# Altium schematic sheet USB_OTG.SchDoc: USB_OTG
size 420 x 297 mm; DrawnBy: Orhun Dabak; Revision: 1.0; SheetNumber: 3; SheetTotal: 7; SPICEModelCacheBLVHRVRQ: <root> / <DocumentId>BLVHRVRQ</DocumentId> / </root>
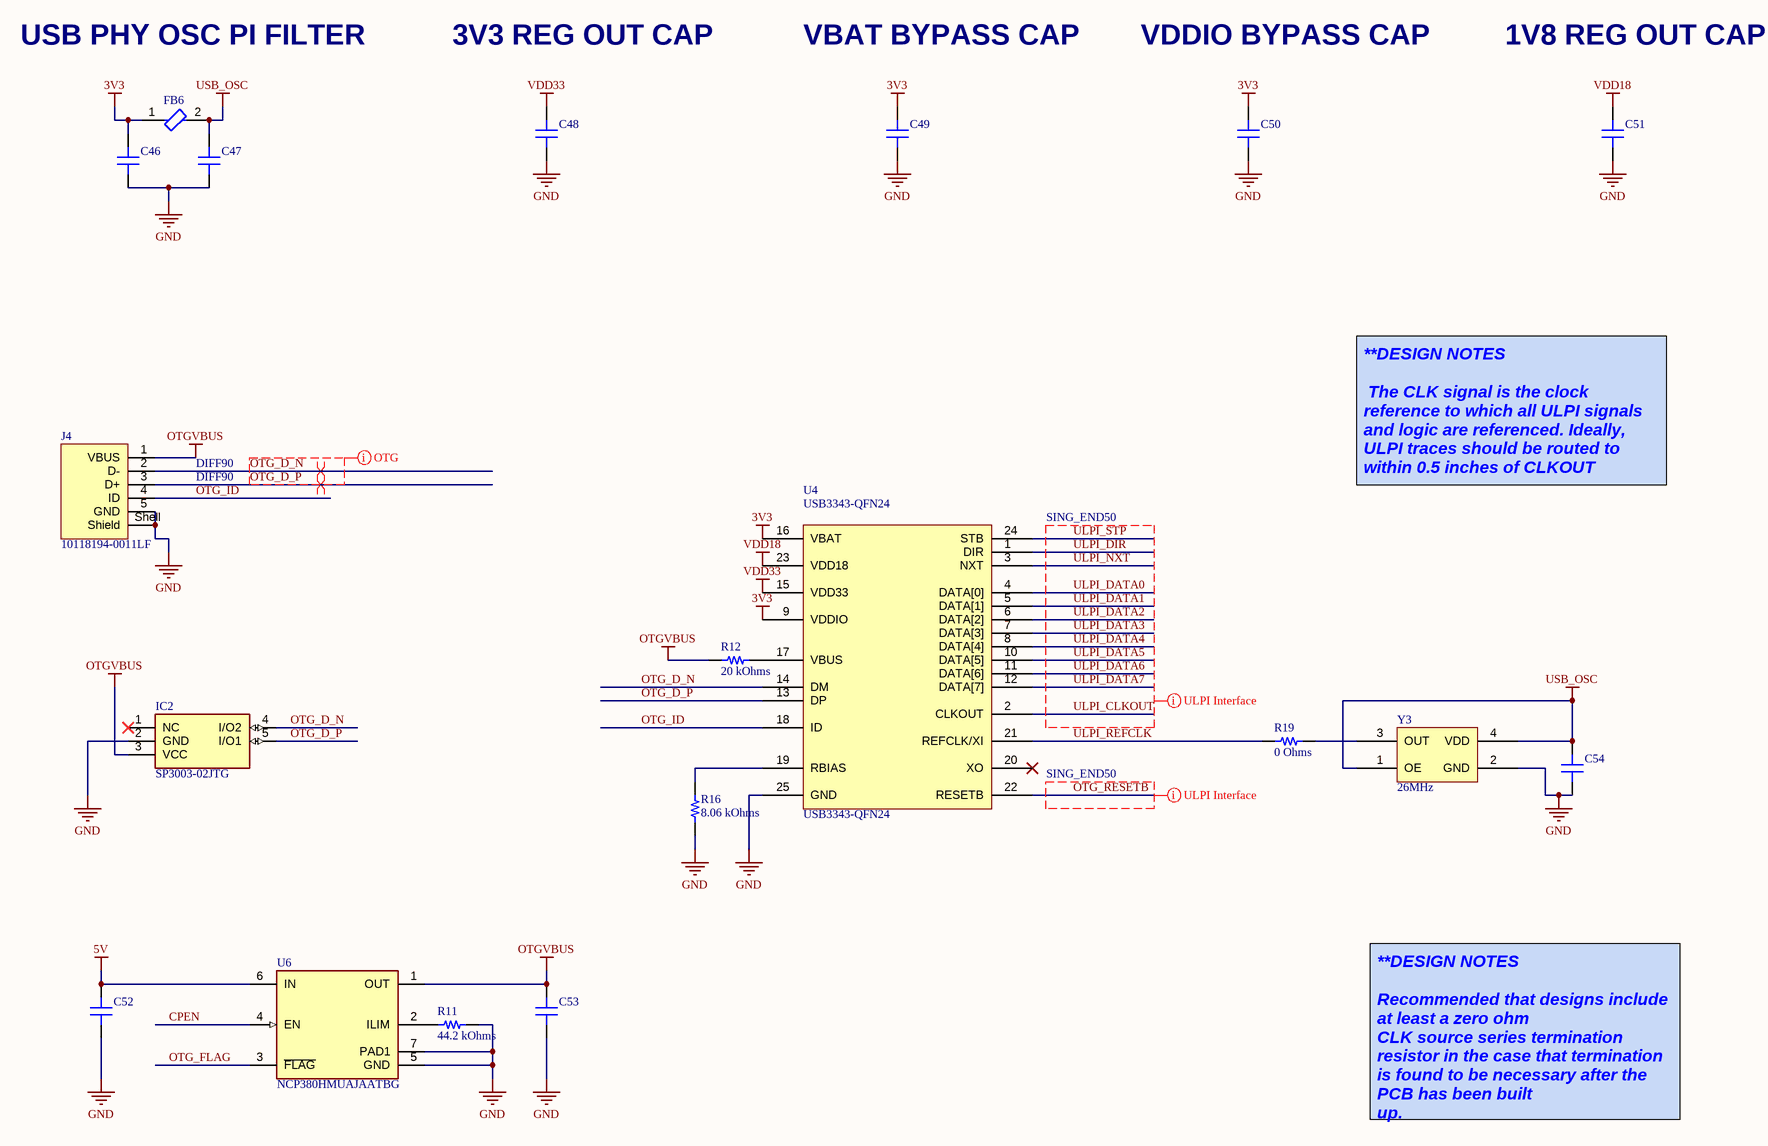
[diagram p0: USB_OTG.SchDoc]

## Parts
?  (no value)  (graphical)
C46  4.7 µF  [CAP 0402_1005]  (value not drawn)
C47  4.7 µF  [CAP 0402_1005]  (value not drawn)
C48  4.7µF  [CAP 0402_1005]  (value not drawn)
C49  0.1 µF  [CAP 0402_1005]  (value not drawn)
C50  0.1 µF  [CAP 0402_1005]  (value not drawn)
C51  4.7µF  [CAP 0402_1005]  (value not drawn)
C52  10 µF  [CAP 0402_1005]  (value not drawn)
C53  4.7 µF  [CAP 1210_3225 - 1MM]  (value not drawn)
C54  10000 pF  [CAP 0402_1005]  (value not drawn)
FB6  BLM15AX601SN1D  [FP-BLM15-0_05-IPC_B]  (value not drawn)
IC2  SP3003-02JTG  [SOT65P220X110-5N]
J4  10118194-0011LF  [10118194-0011LF]
R11  44.2 kOhms  [RES 0402_1005]
R12  20 kOhms  [RES 0402_1005]
R16  8.06 kOhms  [RES 0402_1005]
R19  0 Ohms  [RES 0402_1005]
U4  USB3343-QFN24  [QFN50P400X400X85_HS-25N]
U6  NCP380HMUAJAATBG  [FP-517AB-MFG]
Y3  26MHz  [ABRACON ASVTX-11]

## Nets
3V3: C46.2 C49.2 C50.2 FB6.1 U4.9(VDDIO) U4.16(VBAT)
5V: C52.2 U6.6(IN)
GND: C46.1 C47.1 C48.1 C49.1 C50.1 C51.1 C52.1 C53.1 C54.1 IC2.2(GND) J4.5(GND) J4.Shell(Shield) R11.2 R16.2 U4.25(GND) U6.5(GND) U6.7(PAD1) Y3.2(GND)
OTGVBUS: C53.2 IC2.3(VCC) J4.1(VBUS) R12.1 U6.1(OUT)
USB_OSC: C47.2 C54.2 FB6.2 Y3.1(OE) Y3.4(VDD)
VDD18: C51.2 U4.23(VDD18)
VDD33: C48.2 U4.15(VDD33)
CPEN: U6.4(EN)
OTG_D_N: IC2.4(I/O2) J4.2(D-) U4.14(DM)
OTG_D_P: IC2.5(I/O1) J4.3(D+) U4.13(DP)
OTG_FLAG: U6.3(~{FLAG})
OTG_ID: J4.4(ID) U4.18(ID)
OTG_RESETB: U4.22(RESETB)
ULPI_CLKOUT: U4.2(CLKOUT)
ULPI_DATA0: U4.4(DATA[0])
ULPI_DATA1: U4.5(DATA[1])
ULPI_DATA2: U4.6(DATA[2])
ULPI_DATA3: U4.7(DATA[3])
ULPI_DATA4: U4.8(DATA[4])
ULPI_DATA5: U4.10(DATA[5])
ULPI_DATA6: U4.11(DATA[6])
ULPI_DATA7: U4.12(DATA[7])
ULPI_DIR: U4.1(DIR)
ULPI_NXT: U4.3(NXT)
ULPI_REFCLK: R19.1 U4.21(REFCLK/XI)
ULPI_STP: U4.24(STB)
NetR11_1: R11.1 U6.2(ILIM)
NetR12_2: R12.2 U4.17(VBUS)
NetR16_1: R16.1 U4.19(RBIAS)
NetR19_2: R19.2 Y3.3(OUT)

Not connected (* = marked no-connect by the designer): IC2 1(NC)*; U4 20(XO)*

## Layout directives
net class SING_END50; net class ULPI: OTG_RESETB, ULPI_CLKOUT, ULPI_DATA0, ULPI_DATA1, ULPI_DATA2, ULPI_DATA3, ULPI_DATA4, ULPI_DATA5, ULPI_DATA6, ULPI_DATA7, ULPI_DIR, ULPI_NXT, ULPI_STP
differential pair; differential pair class DIFF90: OTG_D_N, OTG_D_P
net class *OTG: OTG_D_N, OTG_D_P

## Notes on the sheet
- USB PHY OSC PI FILTER
- 3V3 REG OUT CAP
- VBAT BYPASS CAP
- VDDIO BYPASS CAP
- 1V8 REG OUT CAP
- **DESIGN NOTES
  The CLK signal is the clock reference to which all ULPI signals and logic are referenced. Ideally, ULPI traces should be routed to within 0.5 inches of CLKOUT
- **DESIGN NOTES
  Recommended that designs include at least a zero ohm
  CLK source series termination resistor in the case that termination is found to be necessary after the PCB has been built
  up.
- Title:
- Project:
- Size:
- Date:
- File:
- A3
- Time:
- Drawn By:
- Sheet:
- Revision:
- Of

## Library data of the parts
? = Title_Block
C46 C47 = CL05A475MP5NRNC: CAP CER 4.7UF 10V X5R 0402; manufacturer: Samsung Electro-Mechanics; Tolerance: ±20%; Part Number: CL05A475MP5NRNC; Value: 4.7 µF; Applications: General Purpose; Capacitance: 4.7 µF; componentlink1description: Datasheet; componentlink1url: http://www.samsungsem.com/kr/support/product-search/mlcc/CL05A475MP5NRNC.jsp; componentlink2description: DigiKey Link; componentlink2url: https://www.digikey.com/en/products/detail/samsung-electro-mechanics/CL05A475MP5NRNC/3887140; Device Package: 0402 (1005 Metric); lastupdated: 19/09/2022 12:57:17; Lifecycle Status: Active; Minimum Order: 1; Mounting Type: Surface Mount, MLCC; Operating Temperature: -55°C ~ 85°C; Package / Case: 0402 (1005 Metric); packaging: TapeAndReel; partid: 7650; Part Status: Active; price: 0.01; series: CL; Size / Dimension: 0.039" L x 0.020" W (1.00mm x 0.50mm); Supplier 1: DigiKey; Supplier Part Number 1: 1276-1482-1-ND; Temperature Coefficient: X5R; Thickness (Max): 0.022" (0.55mm); Voltage - Rated: 10V
C48 C51 = 0402YD475MAT2A: CAP CER 4.7UF 16V X5R 0402; manufacturer: AVX Corporation; Tolerance: ±20%; Part Number: 0402YD475MAT2A; Value: 4.7µF; Applications: General Purpose; Capacitance: 4.7µF; componentlink1description: Datasheet; componentlink1url: http://datasheets.avx.com/cx5r.pdf; componentlink2description: DigiKey Link; componentlink2url: http://digikey.com/product-detail/en/avx-corporation/0402YD475MAT2A/478-10788-1-ND/7536324; Device Package: 0402 (1005 Metric); lastupdated: 08/02/2022 12:26:39; Lifecycle Status: Active; Minimum Order: 1; Mounting Type: Surface Mount, MLCC; Operating Temperature: -55°C ~ 85°C; Package / Case: 0402 (1005 Metric); packaging: TapeAndReel; partid: 12460; Part Status: Active; price: 0.06; series: -; Size / Dimension: 0.039" L x 0.020" W (1.00mm x 0.50mm); Supplier 1: DigiKey; Supplier Part Number 1: 478-10788-1-ND; Temperature Coefficient: X5R; Thickness (Max): 0.028" (0.71mm); Voltage - Rated: 16V
C49 C50 = CC0402KRX7R6BB104: CAP CER 0.1UF 10V X7R 0402; manufacturer: Yageo; Tolerance: ±10%; Part Number: CC0402KRX7R6BB104; Value: 0.1 µF; Applications: General Purpose; Capacitance: 0.1 µF; componentlink1description: Datasheet; componentlink1url: https://www.yageo.com/upload/media/product/productsearch/datasheet/mlcc/UPY-GPHC_X7R_6.3V-to-50V_18.pdf; componentlink2description: DigiKey Link; componentlink2url: https://www.digikey.com/en/products/detail/yageo/CC0402KRX7R6BB104/2103083; Device Package: 0402 (1005 Metric); lastupdated: 19/09/2022 12:57:28; Lifecycle Status: Active; Minimum Order: 1; Mounting Type: Surface Mount, MLCC; Operating Temperature: -55°C ~ 125°C; Package / Case: 0402 (1005 Metric); packaging: CutTape; partid: 3877; Part Status: Active; price: 0.01; series: CC; Size / Dimension: 0.039" L x 0.020" W (1.00mm x 0.50mm); Supplier 1: DigiKey; Supplier Part Number 1: 311-1345-1-ND; Temperature Coefficient: X7R; Thickness (Max): 0.022" (0.55mm); Voltage - Rated: 10V
C52 = CL05A106MP8NUB8: CAP CER 10UF 10V X5R 0402; manufacturer: Samsung Electro-Mechanics; Tolerance: ±20%; Part Number: CL05A106MP8NUB8; Value: 10 µF; Applications: General Purpose; Capacitance: 10 µF; componentlink1description: Datasheet; componentlink1url: http://www.samsungsem.com/kr/support/product-search/mlcc/CL05A106MP8NUB8.jsp; componentlink2description: DigiKey Link; componentlink2url: https://www.digikey.com/en/products/detail/samsung-electro-mechanics/CL05A106MP8NUB8/5961314; Device Package: 0402 (1005 Metric); lastupdated: 19/09/2022 12:57:36; Lifecycle Status: Active; Minimum Order: 1; Mounting Type: Surface Mount, MLCC; Operating Temperature: -55°C ~ 85°C; Package / Case: 0402 (1005 Metric); packaging: TapeAndReel; partid: 1758; Part Status: Active; price: 0.06; series: CL; Size / Dimension: 0.039" L x 0.020" W (1.00mm x 0.50mm); Supplier 1: DigiKey; Supplier Part Number 1: 1276-6830-1-ND; Temperature Coefficient: X5R; Thickness (Max): 0.035" (0.90mm); Voltage - Rated: 10V
C53 = GMK325BJ475MN-T: CAP CER 4.7UF 35V X5R 1210; manufacturer: Taiyo Yuden; Tolerance: ±20%; Part Number: GMK325BJ475MN-T; Value: 4.7 µF; Applications: SMPS Filtering; Capacitance: 4.7 µF; componentlink1description: Datasheet; componentlink1url: https://www.yuden.co.jp/productdata/catalog/mlcc01_e.pdf; componentlink2description: DigiKey Link; componentlink2url: https://www.digikey.com/en/products/detail/taiyo-yuden/GMK325BJ475MN-T/1212781; Device Package: 1210 (3225 Metric); lastupdated: 19/09/2022 13:23:33; Lifecycle Status: Active; Minimum Order: 1; Mounting Type: Surface Mount, MLCC; Operating Temperature: -55°C ~ 85°C; Package / Case: 1210 (3225 Metric); packaging: TapeAndReel; partid: 24444; Part Status: Active; price: 0.11; series: M; Size / Dimension: 0.126" L x 0.098" W (3.20mm x 2.50mm); Supplier 1: DigiKey; Supplier Part Number 1: 587-1781-1-ND; Temperature Coefficient: X5R; Thickness (Max): 0.083" (2.10mm); Voltage - Rated: 35V
C54 = C0402C103K5RECAUTO: CAP CER 0402 10NF 50V X7R 10%; manufacturer: KEMET; Part Number: C0402C103K5RECAUTO; Value: 10000 pF; Applications: Automotive, ESD Protection; Capacitance: 10000 pF; componentlink1description: Datasheet; componentlink1url: https://api.kemet.com/component-edge/download/datasheet/C0402C103K5RECAUTO.pdf; componentlink2description: DigiKey Link; componentlink2url: https://www.digikey.com/en/products/detail/kemet/C0402C103K5RECAUTO/8646477; Device Package: 0402 (1005 Metric); lastupdated: 19/09/2022 12:56:43; Lifecycle Status: Active; Minimum Order: 1; Mounting Type: Surface Mount, MLCC; Operating Temperature: -55°C ~ 125°C; Package / Case: 0402 (1005 Metric); packaging: TapeAndReel; partid: 38916; Part Status: Active; price: 0.01; Ratings: AEC-Q200; series: ESD SMD Auto X7R; Size / Dimension: 0.039" L x 0.020" W (1.00mm x 0.50mm); Supplier 1: DigiKey; Supplier Part Number 1: 399-C0402C103K5RECAUTOCT-ND; Temperature Coefficient: X7R; Thickness (Max): 0.022" (0.55mm); Tolerance: ±10%; Voltage - Rated: 50V
FB6 = CMP-0686-00246-4: Chip Ferrite Bead, 0402, 600Ω @ 100MHz, 0.34Ω, 25%, 500mA; Material: Steel; DC Resistance (DCR): 340mR; Impedance: 600R; Number of Circuits: 1; Max Current Rating: 500mA; Core Material: Ferrite; Lead Free: Lead Free; Series: BLM15AX_SN; Number of Pins: 2; Package Quantity: 1; Length: 1mm; Height: 0.5mm; Width: 0.5mm; Packaging: Tape and Reel; RoHS Compliant: Yes; Test Frequency: 100MHz; Case Code (Imperial): 0402; Depth: 0.5mm; Case/Package: 0402; Min Operating Temperature: -55°C; Max Operating Temperature: 125°C; Max DC Current: 500mA; Current Rating: 500mA; REACH SVHC: No SVHC; Termination: SMD/SMT; Tolerance: 25%; Case Code (Metric): 1005; Number of Lines: 1; DC Resistance-Max: 340mR
IC2 = SP3003-02JTG: Integrated Circuit; Manufacturer_Name: LITTELFUSE; Datasheet Link: https://datasheet.datasheetarchive.com/originals/distributors/Datasheets-DGA26/1840396.pdf; Height: 1.1mm; Manufacturer_Part_Number: SP3003-02JTG; Mouser Part Number: 576-SP3003-02JTG; Mouser Price/Stock: https://www.mouser.co.uk/ProductDetail/Littelfuse/SP3003-02JTG?qs=je4hkJKt%2FJ1VE%2FhJSW73jg%3D%3D; Arrow Part Number: SP3003-02JTG; Arrow Price/Stock: https://www.arrow.com/en/products/sp3003-02jtg/littelfuse?region=nac
J4 = 10118194-0011LF: USB - micro B USB 2.0 Receptacle Connector 5 Position Surface Mount, Right Angle; Through Hole; Manufacturer: Amphenol ICC (FCI); Manufacturer Standard Lead Time: 9 Week; Product Status: Active; Number of Contacts: 5; Specifications: USB 2.0; Number of Ports: 1; Current Rating (Amps): 1.8A per Contact; Voltage - Rated: 100VAC; Mating Cycles: 10000; Shielding: Shielded; Material Flammability Rating: UL94 V-0; Digi-Key Part Number: 10118194-0011LF-ND; Manufacturer Product Number: 10118194-0011LF; Category: Connectors, Interconnects USB, DVI, HDMI Connectors USB, DVI, HDMI Connector Assemblies; Series: -; Package: Tape & Reel (TR); Connector Type: USB - Micro B; ComponentLink1Description: Digi-Key Link; ComponentLink1URL: https://www.digikey.com/en/products/detail/amphenol-cs-fci/10118194-0011LF/681; ComponentLink2Description: Datasheet; ComponentLink2URL: https://www.amphenol-cs.com/media/wysiwyg/files/drawing/10118194.pdf; Supplier 1: Digi-Key; Supplier Part Number 1: 10118194-0011LF-ND; Gender: Receptacle; Mounting Type: Surface Mount, Right Angle; Through Hole; Mounting Feature: Horizontal; Termination: Solder; Features: Solder Retention; Ingress Protection: -; Operating Temperature: -30°C ~ 80°C; Contact Finish: Gold; Shell/Shielding Material: Steel, Stainless; Insulation Color: Black; Base Product Number: 10118194
R11 = RC0402FR-0744K2L: RES 44.2K OHM 1% 1/16W 0402; Manufacturer: Yageo; Power (Watts): 0.063W, 1/16W; Temperature Coefficient: ±100ppm/°C; Part Number: RC0402FR-0744K2L; Value: 44.2 kOhms; ComponentLink1Description: Datasheet; ComponentLink1URL: https://www.yageo.com/upload/media/product/productsearch/datasheet/rchip/PYu-RC_Group_51_RoHS_L_10.pdf; ComponentLink2Description: DigiKey Link; ComponentLink2URL: https://www.digikey.com/en/products/detail/yageo/RC0402FR-0744K2L/5281023; Composition: Thick Film; Device Package: 0402 (1005 Metric); Features: Moisture Resistant; Height - Seated (Max): 0.016" (0.40mm); LastUpdated: 1/2/2023 08:21:51 PM; Lifecycle Status: Active; Minimum Order: 1; Number of Terminations: 2; Operating Temperature: -55°C ~ 155°C; Package / Case: 0402 (1005 Metric); Packaging: CutTape; PartId: 2628; Part Status: Active; Price: 0.01; Resistance: 44.2 kOhms; Series: RC_L; Size / Dimension: 0.039" L x 0.020" W (1.00mm x 0.50mm); Supplier 1: DigiKey; Supplier Part Number 1: YAG3163CT-ND; Supplier Device Package: 0402; Tolerance: ±1%
R12 = RC0402JR-0720KL: RES 20K OHM 5% 1/16W 0402; Manufacturer: Yageo; Power (Watts): 0.063W, 1/16W; Temperature Coefficient: ±100ppm/°C; Part Number: RC0402JR-0720KL; Value: 20 kOhms; ComponentLink1Description: Datasheet; ComponentLink1URL: https://www.yageo.com/upload/media/product/productsearch/datasheet/rchip/PYu-RC_Group_51_RoHS_L_10.pdf; ComponentLink2Description: DigiKey Link; ComponentLink2URL: https://www.digikey.com/en/products/detail/yageo/RC0402JR-0720KL/2827648; Composition: Thick Film; Device Package: 0402 (1005 Metric); Features: Moisture Resistant; Height - Seated (Max): 0.016" (0.40mm); LastUpdated: 1/2/2023 08:21:42 PM; Lifecycle Status: Active; Minimum Order: 1; Number of Terminations: 2; Operating Temperature: -55°C ~ 155°C; Package / Case: 0402 (1005 Metric); Packaging: CutTape; PartId: 4787; Part Status: Active; Price: 0.01; Resistance: 20 kOhms; Series: RC_L; Size / Dimension: 0.039" L x 0.020" W (1.00mm x 0.50mm); Supplier 1: DigiKey; Supplier Part Number 1: 311-20KJRCT-ND; Supplier Device Package: 0402; Tolerance: ±5%
R16 = RC0402FR-078K06L: RES 8.06K OHM 1% 1/16W 0402; Manufacturer: Yageo; Power (Watts): 0.063W, 1/16W; Temperature Coefficient: ±100ppm/°C; Part Number: RC0402FR-078K06L; Value: 8.06 kOhms; ComponentLink1Description: Datasheet; ComponentLink1URL: https://www.yageo.com/upload/media/product/productsearch/datasheet/rchip/PYu-RC_Group_51_RoHS_L_10.pdf; ComponentLink2Description: DigiKey Link; ComponentLink2URL: https://www.digikey.com/en/products/detail/yageo/RC0402FR-078K06L/726661; Composition: Thick Film; Device Package: 0402 (1005 Metric); Features: Moisture Resistant; Height - Seated (Max): 0.016" (0.40mm); LastUpdated: 1/2/2023 08:21:51 PM; Lifecycle Status: Active; Minimum Order: 1; Number of Terminations: 2; Operating Temperature: -55°C ~ 155°C; Package / Case: 0402 (1005 Metric); Packaging: CutTape; PartId: 2529; Part Status: Active; Price: 0.01; Resistance: 8.06 kOhms; Series: RC_L; Size / Dimension: 0.039" L x 0.020" W (1.00mm x 0.50mm); Supplier 1: DigiKey; Supplier Part Number 1: 311-8.06KLRCT-ND; Supplier Device Package: 0402; Tolerance: ±1%
R19 = RC0402JR-070RL: RES 0 OHM JUMPER 1/16W 0402; Manufacturer: Yageo; Power (Watts): 0.063W, 1/16W; Part Number: RC0402JR-070RL; Value: 0 Ohms; ComponentLink1Description: Datasheet; ComponentLink1URL: https://www.yageo.com/upload/media/product/productsearch/datasheet/rchip/PYu-RC_Group_51_RoHS_L_10.pdf; ComponentLink2Description: DigiKey Link; ComponentLink2URL: https://www.digikey.com/en/products/detail/yageo/RC0402JR-070RL/726406; Composition: Thick Film; Device Package: 0402 (1005 Metric); Features: Moisture Resistant; Height - Seated (Max): 0.016" (0.40mm); LastUpdated: 1/2/2023 08:20:46 PM; Lifecycle Status: Active; Minimum Order: 1; Number of Terminations: 2; Operating Temperature: -55°C ~ 155°C; Package / Case: 0402 (1005 Metric); Packaging: CutTape; PartId: 17588; Part Status: Active; Price: 0.01; Resistance: 0 Ohms; Series: RC_L; Size / Dimension: 0.039" L x 0.020" W (1.00mm x 0.50mm); Supplier 1: DigiKey; Supplier Part Number 1: 311-0.0JRCT-ND; Supplier Device Package: 0402; Tolerance: Jumper
U6 = CMP-07121-000001-1: IC PWR SWITCH P-CHAN 1:1 6UDFN; Manufacturer: ON Semiconductor; Max Power Dissipation: 830mW; Standoff Height: 0mm; Nominal Supply Current: 90uA; Max Supply Voltage: 5.5V; Number Of Outputs: 1; Max Junction Temp: +125°C; Output Current: 0.5-2.1A; Min Supply Voltage: 2.5V; ComponentLink2Description: Datasheet; Device Class L3: unset; Device Class L1: Integrated Circuits (ICs); ComponentLink2URL: https://www.onsemi.com/pub/Collateral/NCP380-D.PDF; Digikey Description: IC PWR SWITCH P-CHAN 1:1 6UDFN; Package: 517AB; Temperature: -40°C to +125°C; RoHS: TRUE; Footprint Url: https://www.onsemi.com/pub/Collateral/517AB.PDF; Automotive: No; Manufacturer Part Number: NCP380HMUAJAATBG; Octopart: https://octopart.com/ncp380hmuajaatbg-on+semiconductor-19977070; Lead Free: Yes; Ambient Temperature Range High: +85°C; Mouser Description: Power Switch ICs - Power Distribution OVER CURRENT PROTECTION; Category: IC; Temperature Range High: +125°C; Device Class L2: Power Management ICs; Ambient Temperature Range Low: -40°C; Height: 0.55mm; Temperature Range Low: -40°C
Y3 = ASVTX-11-A-26.000MHZ-T: XTAL OSC VCTCXO 26.0000MHZ SNWV; Manufacturer: Abracon LLC; Base Resonator: Crystal; Current - Supply (Max): 2mA; Frequency Stability: ±2.5ppm; Output: Clipped Sine Wave; Voltage - Supply: 3V; Part Number: ASVTX-11-A-26.000MHZ-T; ComponentLink1Description: Datasheet; ComponentLink1URL: https://abracon.com/Oscillators/ASTX11_ASVTX11.pdf; ComponentLink2Description: DigiKey Link; ComponentLink2URL: http://digikey.com/product-detail/en/abracon-llc/ASVTX-11-A-26.000MHZ-T/535-9619-1-ND/1237086; Frequency: 26MHz; Height - Seated (Max): 0.039" (1.00mm); LastUpdated: 19/09/2022 13:51:47; Lifecycle Status: Active; Minimum Order: 1; Mounting Type: Surface Mount; Operating Temperature: -30°C ~ 75°C; Package / Case: 6-SMD, No Lead; Packaging: TapeAndReel; PartId: 249; Part Status: Active; Price: 2.37; Series: ASVTX-11; Size / Dimension: 0.126" L x 0.098" W (3.20mm x 2.50mm); Supplier 1: DigiKey; Supplier Part Number 1: 535-9619-1-ND; Type: VCTCXO; Value: 26MHz